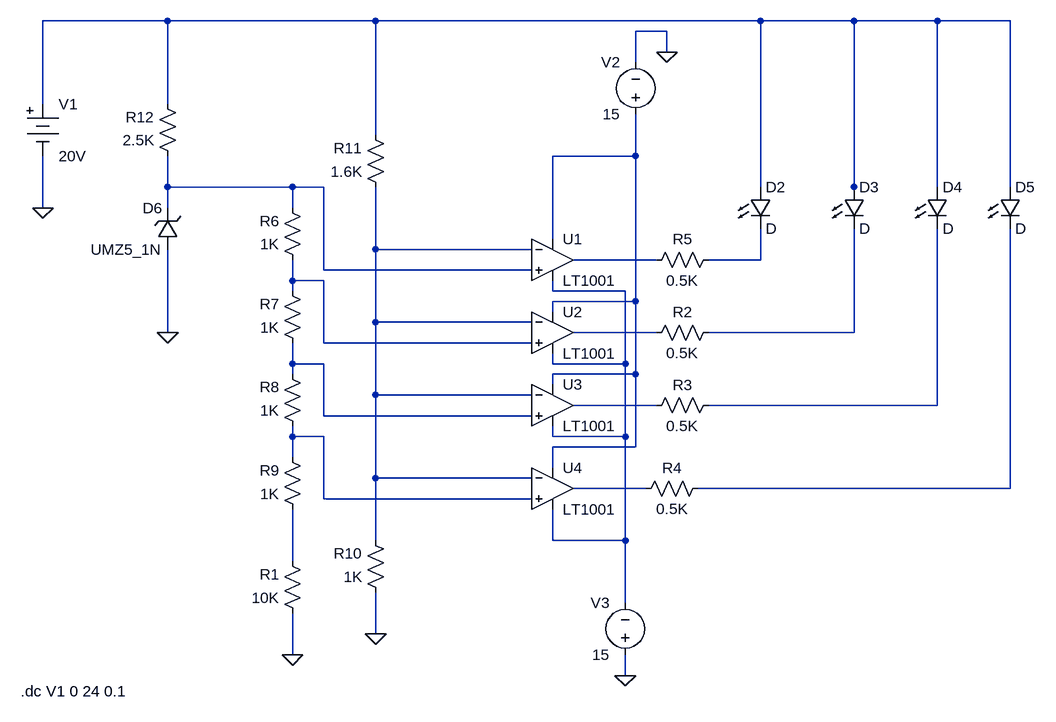
[diagram p0: schematic Project.asc]
Project.asc, the LTspice schematic file:
Version 4
SHEET 1 1020 920
WIRE -336 -128 -528 -128
WIRE -16 -128 -336 -128
WIRE 576 -128 -16 -128
WIRE 720 -128 576 -128
WIRE 848 -128 720 -128
WIRE 960 -128 848 -128
WIRE 432 -112 384 -112
WIRE 432 -80 432 -112
WIRE 384 -64 384 -112
WIRE -528 0 -528 -128
WIRE -336 0 -336 -128
WIRE -16 48 -16 -128
WIRE 384 80 384 16
WIRE 384 80 256 80
WIRE -336 128 -336 80
WIRE -144 128 -336 128
WIRE -96 128 -144 128
WIRE 576 128 576 -128
WIRE 720 128 720 -128
WIRE 848 128 848 -128
WIRE 960 128 960 -128
WIRE 720 144 720 128
WIRE -528 160 -528 80
WIRE -336 160 -336 128
WIRE -144 160 -144 128
WIRE 256 208 256 80
WIRE -16 224 -16 128
WIRE 224 224 -16 224
WIRE 416 240 288 240
WIRE 576 240 576 192
WIRE 576 240 496 240
WIRE -96 256 -96 128
WIRE 224 256 -96 256
WIRE -144 272 -144 240
WIRE -96 272 -144 272
WIRE -144 288 -144 272
WIRE 256 288 256 272
WIRE 368 288 256 288
WIRE 384 304 384 80
WIRE 384 304 256 304
WIRE 256 320 256 304
WIRE -16 336 -16 224
WIRE 224 336 -16 336
WIRE -336 352 -336 224
WIRE 416 352 288 352
WIRE 720 352 720 192
WIRE 720 352 496 352
WIRE -96 368 -96 272
WIRE 224 368 -96 368
WIRE -144 400 -144 368
WIRE -96 400 -144 400
WIRE 256 400 256 384
WIRE 368 400 368 288
WIRE 368 400 256 400
WIRE -144 416 -144 400
WIRE 384 416 384 304
WIRE 384 416 256 416
WIRE 256 432 256 416
WIRE -16 448 -16 336
WIRE 224 448 -16 448
WIRE 416 464 288 464
WIRE 848 464 848 192
WIRE 848 464 496 464
WIRE -96 480 -96 400
WIRE 224 480 -96 480
WIRE -144 512 -144 496
WIRE -96 512 -144 512
WIRE 256 512 256 496
WIRE 368 512 368 400
WIRE 368 512 256 512
WIRE 384 528 384 416
WIRE 384 528 256 528
WIRE -144 544 -144 512
WIRE 256 560 256 528
WIRE -16 576 -16 448
WIRE 224 576 -16 576
WIRE 400 592 288 592
WIRE 960 592 960 192
WIRE 960 592 480 592
WIRE -96 608 -96 512
WIRE 224 608 -96 608
WIRE -16 672 -16 576
WIRE 256 672 256 624
WIRE 368 672 368 512
WIRE 368 672 256 672
WIRE -144 704 -144 624
WIRE 368 768 368 672
WIRE -16 816 -16 752
WIRE -144 848 -144 784
WIRE 368 880 368 848
FLAG -144 848 0
FLAG -16 816 0
FLAG -336 352 0
FLAG 368 880 0
FLAG 432 -80 0
FLAG -528 160 0
SYMBOL OpAmps\\LT1001 256 176 R0
SYMATTR InstName U1
SYMBOL OpAmps\\LT1001 256 288 R0
SYMATTR InstName U2
SYMBOL OpAmps\\LT1001 256 400 R0
SYMATTR InstName U3
SYMBOL OpAmps\\LT1001 256 528 R0
SYMATTR InstName U4
SYMBOL res 512 336 R90
WINDOW 0 0 56 VBottom 2
WINDOW 3 32 56 VTop 2
SYMATTR InstName R2
SYMATTR Value 0.5K
SYMBOL res 512 448 R90
WINDOW 0 0 56 VBottom 2
WINDOW 3 32 56 VTop 2
SYMATTR InstName R3
SYMATTR Value 0.5K
SYMBOL res 496 576 R90
WINDOW 0 0 56 VBottom 2
WINDOW 3 32 56 VTop 2
SYMATTR InstName R4
SYMATTR Value 0.5K
SYMBOL res 512 224 R90
WINDOW 0 0 56 VBottom 2
WINDOW 3 32 56 VTop 2
SYMATTR InstName R5
SYMATTR Value 0.5K
SYMBOL res -128 256 R180
WINDOW 0 36 76 Left 2
WINDOW 3 36 40 Left 2
SYMATTR InstName R6
SYMATTR Value 1K
SYMBOL res -128 384 R180
WINDOW 0 36 76 Left 2
WINDOW 3 36 40 Left 2
SYMATTR InstName R7
SYMATTR Value 1K
SYMBOL res -128 512 R180
WINDOW 0 36 76 Left 2
WINDOW 3 36 40 Left 2
SYMATTR InstName R8
SYMATTR Value 1K
SYMBOL res -128 640 R180
WINDOW 0 36 76 Left 2
WINDOW 3 36 40 Left 2
SYMATTR InstName R9
SYMATTR Value 1K
SYMBOL res 0 768 R180
WINDOW 0 36 76 Left 2
WINDOW 3 36 40 Left 2
SYMATTR InstName R10
SYMATTR Value 1K
SYMBOL res 0 144 R180
WINDOW 0 36 76 Left 2
WINDOW 3 36 40 Left 2
SYMATTR InstName R11
SYMATTR Value 1.6K
SYMBOL res -320 96 R180
WINDOW 0 36 76 Left 2
WINDOW 3 36 40 Left 2
SYMATTR InstName R12
SYMATTR Value 2.5K
SYMBOL LED 560 128 R0
SYMATTR InstName D2
SYMBOL LED 704 128 R0
SYMATTR InstName D3
SYMBOL LED 832 128 R0
SYMATTR InstName D4
SYMBOL LED 944 128 R0
SYMATTR InstName D5
SYMBOL Misc\\battery -528 -16 R0
SYMATTR InstName V1
SYMATTR Value 20V
SYMBOL voltage 384 32 R180
WINDOW 0 24 96 Left 2
WINDOW 3 24 16 Left 2
SYMATTR InstName V2
SYMATTR Value 15
SYMBOL voltage 368 864 R180
WINDOW 0 24 96 Left 2
WINDOW 3 24 16 Left 2
SYMATTR InstName V3
SYMATTR Value 15
SYMBOL res -128 800 R180
WINDOW 0 36 76 Left 2
WINDOW 3 36 40 Left 2
SYMATTR InstName R1
SYMATTR Value 10K
SYMBOL zener -320 224 R180
WINDOW 0 24 64 Left 2
WINDOW 3 24 0 Left 2
SYMATTR InstName D6
SYMATTR Value UMZ5_1N
TEXT -562 904 Left 2 !.dc V1 0 24 0.1

The netlist it stands for:
* Project.asc
XU1 N003 N004 N002 N008 N005 LT1001  ; pins In+ In- V+ V- OUT
XU2 N007 N004 N002 N008 N009 LT1001  ; pins In+ In- V+ V- OUT
XU3 N011 N004 N002 N008 N012 LT1001  ; pins In+ In- V+ V- OUT
XU4 N014 N004 N002 N008 N015 LT1001  ; pins In+ In- V+ V- OUT
R2 N010 N009 0.5K
R3 N013 N012 0.5K
R4 N016 N015 0.5K
R5 N006 N005 0.5K
R6 N007 N003 1K
R7 N011 N007 1K
R8 N014 N011 1K
R9 N017 N014 1K
R10 0 N004 1K
R11 N004 N001 1.6K
R12 N003 N001 2.5K
D2 N001 N006 D
D3 N001 N010 D
D4 N001 N013 D
D5 N001 N016 D
V1 N001 0 20V
V2 N002 0 15
V3 0 N008 15
R1 0 N017 10K
D6 0 N003 UMZ5_1N
.model D D
.lib standard.dio
.dc V1 0 24 0.1
.lib LTC.lib
.backanno
.end